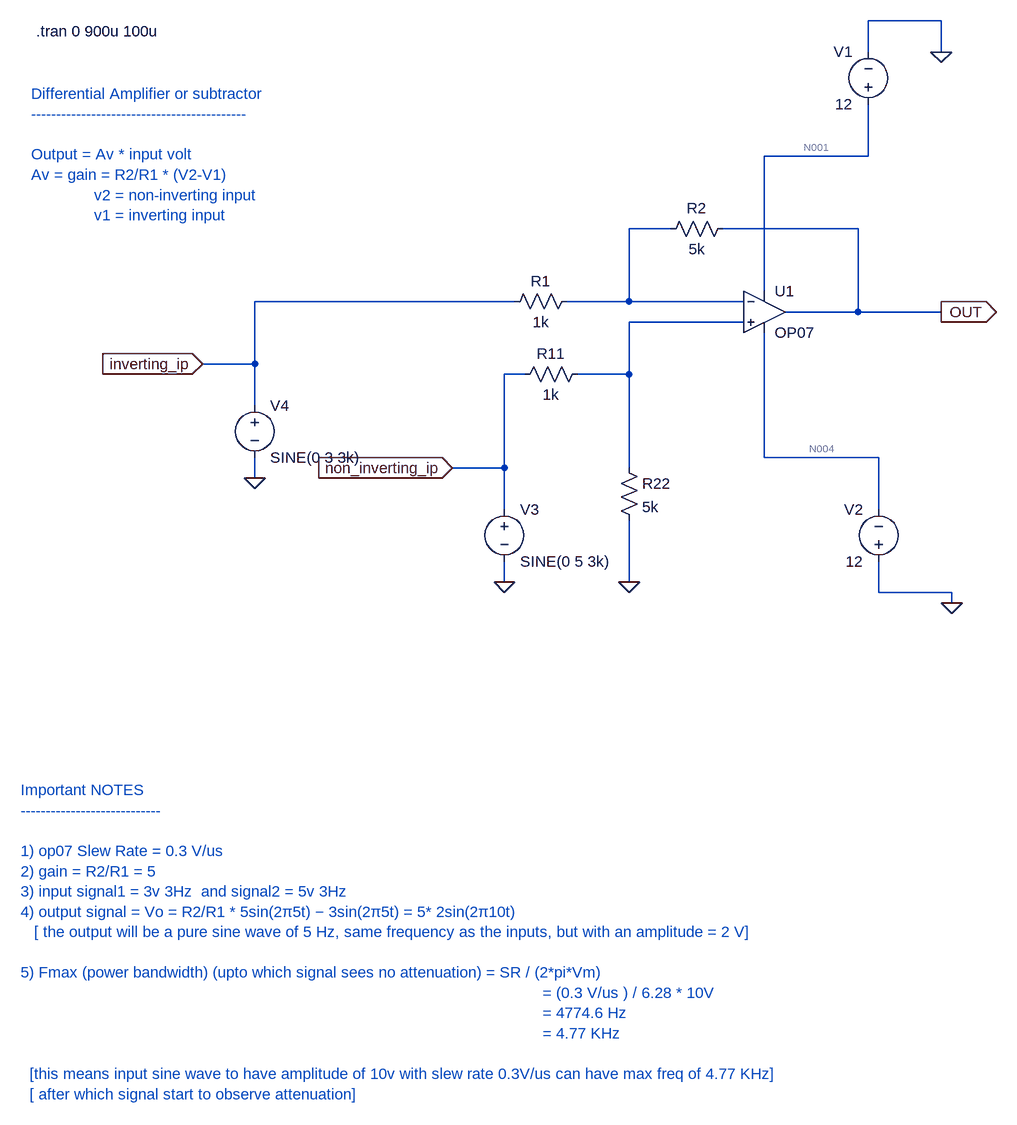
[diagram p0: schematic close_loop_differential_amplifier_with_AC_input.asc]
close_loop_differential_amplifier_with_AC_input.asc, the LTspice schematic file:
Version 4.1
SHEET 1 2948 1308
WIRE 352 -368 240 -368
WIRE 240 -320 240 -368
WIRE 352 -320 352 -368
WIRE 240 -160 240 -240
WIRE 240 -160 80 -160
WIRE -64 -48 -128 -48
WIRE 224 -48 16 -48
WIRE 80 48 80 -160
WIRE -304 64 -704 64
WIRE -128 64 -128 -48
WIRE -128 64 -224 64
WIRE 48 64 -128 64
WIRE 224 80 224 -48
WIRE 224 80 112 80
WIRE 352 80 224 80
WIRE 48 96 -128 96
WIRE -704 160 -704 64
WIRE -704 160 -784 160
WIRE -288 176 -320 176
WIRE -128 176 -128 96
WIRE -128 176 -208 176
WIRE -704 224 -704 160
WIRE 80 304 80 112
WIRE 256 304 80 304
WIRE -320 320 -320 176
WIRE -320 320 -400 320
WIRE -128 320 -128 176
WIRE -704 336 -704 304
WIRE -320 384 -320 320
WIRE 256 384 256 304
WIRE -320 496 -320 464
WIRE -128 496 -128 400
WIRE 256 512 256 464
WIRE 368 512 256 512
WIRE 368 528 368 512
FLAG 352 -320 0
FLAG -320 496 0
FLAG 352 80 OUT
IOPIN 352 80 Out
FLAG -400 320 non_inverting_ip
IOPIN -400 320 In
FLAG -704 336 0
FLAG -784 160 inverting_ip
IOPIN -784 160 In
FLAG 368 528 0
FLAG -128 496 0
SYMBOL voltage 240 -224 R180
WINDOW 0 24 96 Left 2
WINDOW 3 24 16 Left 2
WINDOW 123 0 0 Left 0
WINDOW 39 0 0 Left 0
SYMATTR InstName V1
SYMATTR Value 12
SYMBOL voltage 256 480 R180
WINDOW 0 24 96 Left 2
WINDOW 3 24 16 Left 2
WINDOW 123 0 0 Left 0
WINDOW 39 0 0 Left 0
SYMATTR InstName V2
SYMATTR Value 12
SYMBOL OpAmps\\OP07 80 16 R0
SYMATTR InstName U1
SYMBOL res -208 48 R90
WINDOW 0 0 56 VBottom 2
WINDOW 3 32 56 VTop 2
SYMATTR InstName R1
SYMATTR Value 1k
SYMBOL res 32 -64 R90
WINDOW 0 0 56 VBottom 2
WINDOW 3 32 56 VTop 2
SYMATTR InstName R2
SYMATTR Value 5k
SYMBOL voltage -320 368 R0
WINDOW 123 0 0 Left 0
WINDOW 39 0 0 Left 0
SYMATTR InstName V3
SYMATTR Value SINE(0 5 3k)
SYMBOL voltage -704 208 R0
WINDOW 123 0 0 Left 0
WINDOW 39 0 0 Left 0
SYMATTR InstName V4
SYMATTR Value SINE(0 3 3k)
SYMBOL res -192 160 R90
WINDOW 0 0 56 VBottom 2
WINDOW 3 32 56 VTop 2
SYMATTR InstName R11
SYMATTR Value 1k
SYMBOL res -144 304 R0
SYMATTR InstName R22
SYMATTR Value 5k
TEXT -1040 -352 Left 2 !.tran 0 900u 100u
TEXT -1048 -256 Left 2 ;Differential Amplifier or subtractor\n-------------------------------------------\n \nOutput = Av * input volt\nAv = gain = R2/R1 * (V2-V1)\n              v2 = non-inverting input\n              v1 = inverting input
TEXT -1064 816 Left 2 ;Important NOTES\n----------------------------\n \n1) op07 Slew Rate = 0.3 V/us\n2) gain = R2/R1 = 5\n3) input signal1 = 3v 3Hz  and signal2 = 5v 3Hz\n4) output signal = Vo​ = R2/R1 * 5sin(2π5t) − 3sin(2π5t) = 5* 2sin(2π10t)\n   [ the output will be a pure sine wave of 5 Hz, same frequency as the inputs, but with an amplitude = 2 V]\n \n5) Fmax (power bandwidth) (upto which signal sees no attenuation) = SR / (2*pi*Vm)  \n                                                                                                                    = (0.3 V/us ) / 6.28 * 10V \n                                                                                                                    = 4774.6 Hz \n                                                                                                                    = 4.77 KHz\n \n  [this means input sine wave to have amplitude of 10v with slew rate 0.3V/us can have max freq of 4.77 KHz]\n  [ after which signal start to observe attenuation]

The netlist it stands for:
* close_loop_differential_amplifier_with_AC_input.asc
V1 N001 0 12
V2 0 N004 12
X§U1 N003 N002 N001 N004 OUT LT1001  ; OP07, pins In+ In- V+ V- OUT
R1 N002 inverting_ip 1k
R2 OUT N002 5k
V3 non_inverting_ip 0 SINE(0 5 3k)
V4 inverting_ip 0 SINE(0 3 3k)
R11 N003 non_inverting_ip 1k
R22 N003 0 5k
.tran 0 900u 100u
* Differential Amplifier or subtractor
* -------------------------------------------
* Output = Av * input volt
* Av = gain = R2/R1 * (V2-V1)
*               v2 = non-inverting input
*               v1 = inverting input
* Important NOTES
* ----------------------------
* 1) op07 Slew Rate = 0.3 V/us
* 2) gain = R2/R1 = 5
* 3) input signal1 = 3v 3Hz  and signal2 = 5v 3Hz
* 4) output signal = Vo​ = R2/R1 * 5sin(2π5t) − 3sin(2π5t) = 5* 2sin(2π10t)
*    [ the output will be a pure sine wave of 5 Hz, same frequency as the inputs, but with an amplitude = 2 V]
* 5) Fmax (power bandwidth) (upto which signal sees no attenuation) = SR / (2*pi*Vm)
*                                                                                                                     = (0.3 V/us ) / 6.28 * 10V
*                                                                                                                     = 4774.6 Hz
*                                                                                                                     = 4.77 KHz
*   [this means input sine wave to have amplitude of 10v with slew rate 0.3V/us can have max freq of 4.77 KHz]
*   [ after which signal start to observe attenuation]
.lib LTC.lib
.backanno
.end

* Results of the author's LTspice run, read from the files saved beside the schematic
* Operating Point, zero values left out:
*   V(n004) = -12 V
*   V(n001) = 12 V
*   I(V1) = -2.25 mA
*   I(V2) = -2.25 mA
*   Ix(u1:3) = 2.25 mA
*   Ix(u1:4) = -2.25 mA
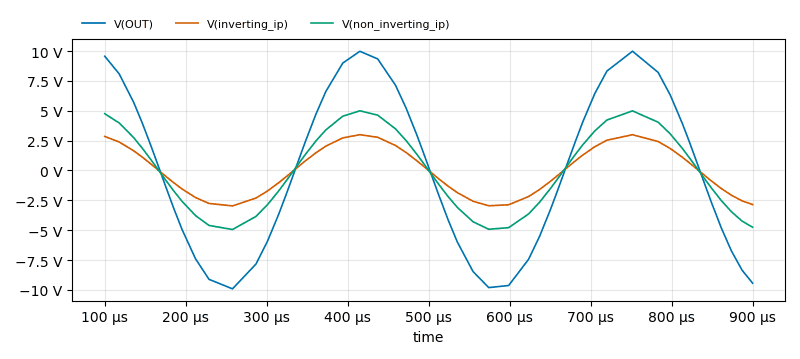
[diagram p1: Transient Analysis of close_loop_differential_amplifier_with_AC_input.asc, plotted from the saved traces]
* Transient Analysis, 1 run:
*   V(OUT): min -9.915 V, max 9.99 V, average 27.18 mV, rms 6.862 V, last -9.44 V
*   V(inverting_ip): min -2.966 V, max 2.999 V, average -1.375 mV, rms 2.059 V, last -2.853 V
*   V(non_inverting_ip): min -4.944 V, max 4.998 V, average -2.292 mV, rms 3.432 V, last -4.755 V